# Altium schematic sheet SUPPLY_DECAP_NW.SchDoc
size A
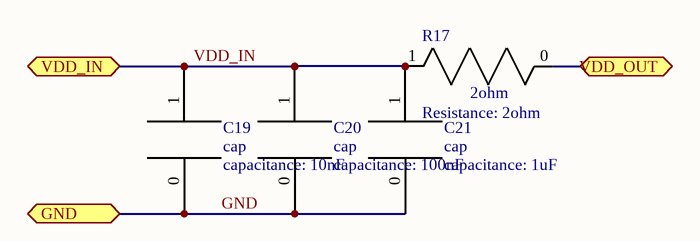
[diagram p0: SUPPLY_DECAP_NW.SchDoc]

## Parts
C19  cap  capacitance: 10nF  [Capacitor]
C20  cap  capacitance: 100nF  [Capacitor]
C21  cap  capacitance: 1uF  [Capacitor]
R17  2ohm  [Resistor]

## Ports
GND, VDD_IN, VDD_OUT

## Nets
GND: C19.0 C20.0 C21.0 ; port GND
VDD_IN: C19.1 C20.1 C21.1 R17.1 ; port VDD_IN
VDD_OUT: R17.0 ; port VDD_OUT

## Library data of the parts
C19-C21 = cap: 0603cap; Rule: UNIONINDEX{}0[]RULEKIND{}SolderMaskExpansion[]NETSCOPE{}AnyNet[]LAYERKIND{}SameLayer[]NAME{}Schematic Solder Mask Expansion[]EXPANSION{}5mil[]UNIT{}Imperial[]PcbType{}ProtelPcb
R17 = res: 0603Res; Rule: UNIONINDEX{}0[]RULEKIND{}SolderMaskExpansion[]NETSCOPE{}AnyNet[]LAYERKIND{}SameLayer[]NAME{}Schematic Solder Mask Expansion[]EXPANSION{}5mil[]UNIT{}Imperial[]PcbType{}ProtelPcb; Resistance: 2ohm